# EAGLE design A2 Drums (EAGLE 8.1.1)
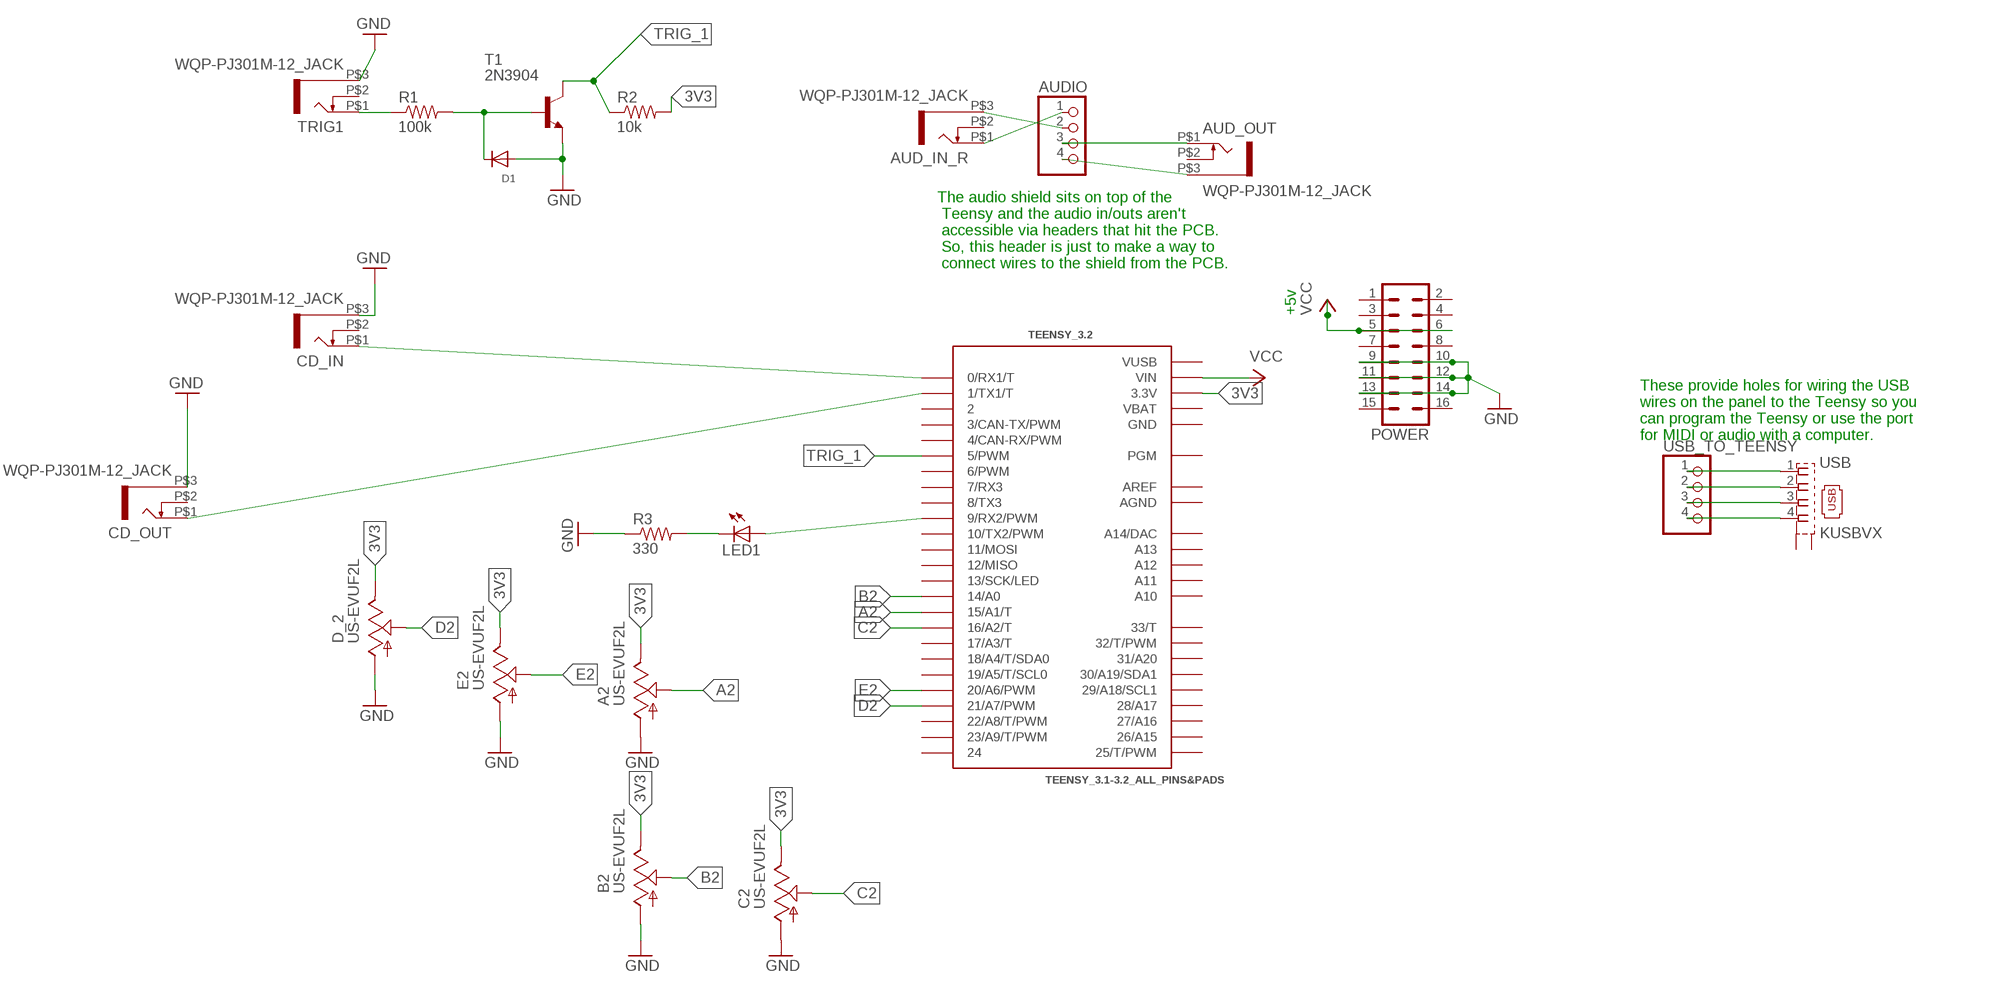
[diagram p0: schematic, sheet 1]

## Parts
A2  US-EVUF2L  [EVUFXL]
AUD_IN_R  WQP-PJ301M-12_JACK  [WQP-PJ301M-12_JACK]
AUD_OUT  WQP-PJ301M-12_JACK  [WQP-PJ301M-12_JACK]
AUDIO  PINHD-1X4  [1X04]
B2  US-EVUF2L  [EVUFXL]
C2  US-EVUF2L  [EVUFXL]
CD_IN  WQP-PJ301M-12_JACK  [WQP-PJ301M-12_JACK]
CD_OUT  WQP-PJ301M-12_JACK  [WQP-PJ301M-12_JACK]
D1  DIODESOD-123  [SOD-123]
D_2  US-EVUF2L  [EVUFXL]
E2  US-EVUF2L  [EVUFXL]
LED1  LED3MM  [LED3MM]
POWER  MA08-2  [MA08-2]
R1  100k  R-US_R0805  [R0805]
R2  10k  R-US_R0805  [R0805]
R3  330  R-US_R0805  [R0805]
T1  2N3904  [TO92]
TEENSY_3.2  TEENSY_3.1-3.2_ALL_PINS&PADS  [TEENSY_3.0-3.2_ALL_PINS_&_PADS]
TRIG1  WQP-PJ301M-12_JACK  [WQP-PJ301M-12_JACK]
USB  KUSBVX  [KUSBVX]
USB_TO_TEENSY  PINHD-1X4  [1X04]

## Nets
3V3: A2.3(E) B2.3(E) C2.3(E) D_2.3(E) E2.3(E) R2.2 TEENSY_3.2.3.3V TEENSY_3.2.3.3V1(3.3V) TEENSY_3.2.3.3V2(3.3V)
A2: A2.2(S) TEENSY_3.2.15/A1(15/A1/T)
B2: B2.2(S) TEENSY_3.2.14/A0
C2: C2.2(S) TEENSY_3.2.16/A2(16/A2/T)
CD_IN: CD_IN.P$1 TEENSY_3.2.0(0/RX1/T)
CD_OUT: CD_OUT.P$1 TEENSY_3.2.1(1/TX1/T)
D2: D_2.2(S) TEENSY_3.2.21/A7(21/A7/PWM)
E2: E2.2(S) TEENSY_3.2.20/A6(20/A6/PWM)
GND: A2.1(A) B2.1(A) C2.1(A) CD_IN.P$3 CD_OUT.P$3 D1.A D_2.1(A) E2.1(A) POWER.9 POWER.10 POWER.11 POWER.12 POWER.13 POWER.14 R3.1 T1.3(E) TRIG1.P$3
IN_R_+: AUD_IN_R.P$1 AUDIO.1
IN_R_-: AUD_IN_R.P$3 AUDIO.2
N$1: LED1.A TEENSY_3.2.9(9/RX2/PWM)
N$2: LED1.K(C) R3.2
N$3: R1.1 TRIG1.P$1
N$4: D1.C R1.2 T1.2(B)
N$38: USB.1 USB_TO_TEENSY.1
N$39: USB.2 USB_TO_TEENSY.2
N$40: USB.3 USB_TO_TEENSY.3
N$41: USB.4 USB_TO_TEENSY.4
OUT_R_+: AUD_OUT.P$1 AUDIO.3
OUT_R_-: AUD_OUT.P$3 AUDIO.4
TRIG_1: R2.1 T1.1(C) TEENSY_3.2.5(5/PWM)
VCC: POWER.5 POWER.6 TEENSY_3.2.VIN
Unconnected: AUD_IN_R.P$2 AUD_OUT.P$2 CD_IN.P$2 CD_OUT.P$2 POWER.1 POWER.2 POWER.3 POWER.4 POWER.7 POWER.8 POWER.15 POWER.16 TEENSY_3.2.2 TEENSY_3.2.3(3/CAN-TX/PWM) TEENSY_3.2.4(4/CAN-RX/PWM) TEENSY_3.2.6(6/PWM) TEENSY_3.2.7(7/RX3) TEENSY_3.2.8(8/TX3) TEENSY_3.2.10(10/TX2/PWM) TEENSY_3.2.11(11/MOSI) TEENSY_3.2.12(12/MISO) TEENSY_3.2.13(13/SCK/LED) TEENSY_3.2.17/A3(17/A3/T) TEENSY_3.2.18/A4(18/A4/T/SDA0) TEENSY_3.2.19/A5(19/A5/T/SCL0) TEENSY_3.2.22/A8(22/A8/T/PWM) TEENSY_3.2.23/A9(23/A9/T/PWM) TEENSY_3.2.24 TEENSY_3.2.25(25/T/PWM) TEENSY_3.2.26(26/A15) TEENSY_3.2.27(27/A16) TEENSY_3.2.28(28/A17) TEENSY_3.2.29(29/A18/SCL1) TEENSY_3.2.30(30/A19/SDA1) TEENSY_3.2.31(31/A20) TEENSY_3.2.32(32/T/PWM) TEENSY_3.2.33(33/T) TEENSY_3.2.A10 TEENSY_3.2.A11 TEENSY_3.2.A12 TEENSY_3.2.A13 TEENSY_3.2.PGM TEENSY_3.2.RESET/DAC(A14/DAC) TRIG1.P$2 USB.M1(S1) USB.M2(S2)

## Notes on the sheet
- The audio shield sits on top of the
   Teensy and the audio in/outs aren't
   accessible via headers that hit the PCB.
   So, this header is just to make a way to
   connect wires to the shield from the PCB.
- +5v
- These provide holes for wiring the USB
  wires on the panel to the Teensy so you 
  can program the Teensy or use the port
  for MIDI or audio with a computer.

## Power pins joined to a net without a drawn wire
AGND: TEENSY_3.2.AGND
AREF: TEENSY_3.2.AREF
GND: TEENSY_3.2.GND TEENSY_3.2.GND1(GND) TEENSY_3.2.GND2(GND)
VBAT: TEENSY_3.2.VBAT
VUSB: TEENSY_3.2.VUSB

## Library data of the parts
A2 B2 C2 D_2 E2 = pot:US-EVU: 9 mm Square Rotary Potentiometers Source: Panasonic
AUD_IN_R AUD_OUT CD_IN CD_OUT TRIG1 = thonkiconn:WQP-PJ301M-12_JACK
AUDIO USB_TO_TEENSY = pinhead:PINHD-1X4: PIN HEADER
D1 = adafruit:DIODE: Diode SMADIODE - SMA Surface Mount Package 20V 1A Schottky Diode Digikey: 641-1014-6-ND DO-1N4148 - Through Hole Small Current Diode SOD-123 20V 1 A (.5mV Vf) Schottky Diode - Digikey: MBRX120TPMSCT-ND SOD-323 10V 570mA (.38mV Vf, 3ns) Schottky Diode - Digikey: ZLLS410CT-ND SOD-523 30V 30mA Schottky Diode (RB751S-40TE61) - Digikey: RB751S-40TE61CT-ND SOT23-R/W - SOT23 Package (R = Solder Paste/Reflow Ovens, W = Hand-Soldering) BAT54Film 40V 300mA - Digikey: 497-7162-1-ND
LED1 = adafruit:LED: LED OSRAM: - CHIPLED LG R971, LG N971, LY N971, LG Q971, LY Q971, LO R971, LY R971 LH N974, LH R974 LS Q976, LO Q976, LY Q976 LO Q996 - Hyper CHIPLED LW Q18S LB Q993, LB Q99A, LB R99A - SideLED LS A670, LO A670, LY A670, LG A670, LP A670 LB A673, LV A673, LT A673, LW A673 LH A674 LY A675 LS A676, LA A676, LO A676, LY A676, LW A676 LS A679, LY A679, LG A679 - Hyper Micro SIDELED® LS Y876, LA Y876, LO Y876, LY Y876 LT Y87S - SmartLED LW L88C, LW L88S LB L89C, LB L89S, LG L890 LS L89K, LO L89K, LY L89K LS L896, LA L896, LO L896, LY L896 - TOPLED LS T670, LO T670, LY T670, LG T670, LP T670 LSG T670, LSP T670, LSY T670, LOP T670, LYG T670 LG T671, LOG T671, LSG T671 LB T673, LV T673, LT T673, LW T673 LH T674 LS T676, LA T676, LO T676, LY T676, LB T676, LH T676, LSB T676, LW T676 LB T67C, LV T67C, LT T67C, LS T67K, LO T67K, LY T67K, LW E67C LS E67B, LA E67B, LO E67B, LY E67B, LB E67C, LV E67C, LT E67C LW T67C LS T679, LY T679, LG T679 LS T770, LO T770, LY T770, LG T770, LP T770 LB T773, LV T773, LT T773, LW T773 LH T774 LS E675, LA E675, LY E675, LS T675 LS T776, LA T776, LO T776, LY T776, LB T776 LHGB T686 LT T68C, LB T68C - Hyper Mini TOPLED® LB M676 - Mini TOPLED Santana® LG M470 LS M47K, LO M47K, LY M47K Source: http://www.osram.convergy.de/
POWER = con-lstb:MA08-2: PIN HEADER; OC_FARNELL: unknown; OC_NEWARK: unknown
R1-R3 = resistor:R-US_: RESISTOR, American symbol
T1 = transistor:2N3904: NPN TRANSISTOR
TEENSY_3.2 = Teensy_3_and_LC_Series_Boards_v1.4:TEENSY_3.1-3.2_ALL_PINS&PADS: Footprint for Teensy 3.1 or 3.2 board using all pads and all through-holes. Pads need a 2x7 0.1" SMD header.
USB = con-kycon:KUSBVX: Vertical,Top Entry Universal Serial Bus Connector KUSBVX Series Source: KYCON Sibalco USB vertical socket KUSBV.pdf

## Board
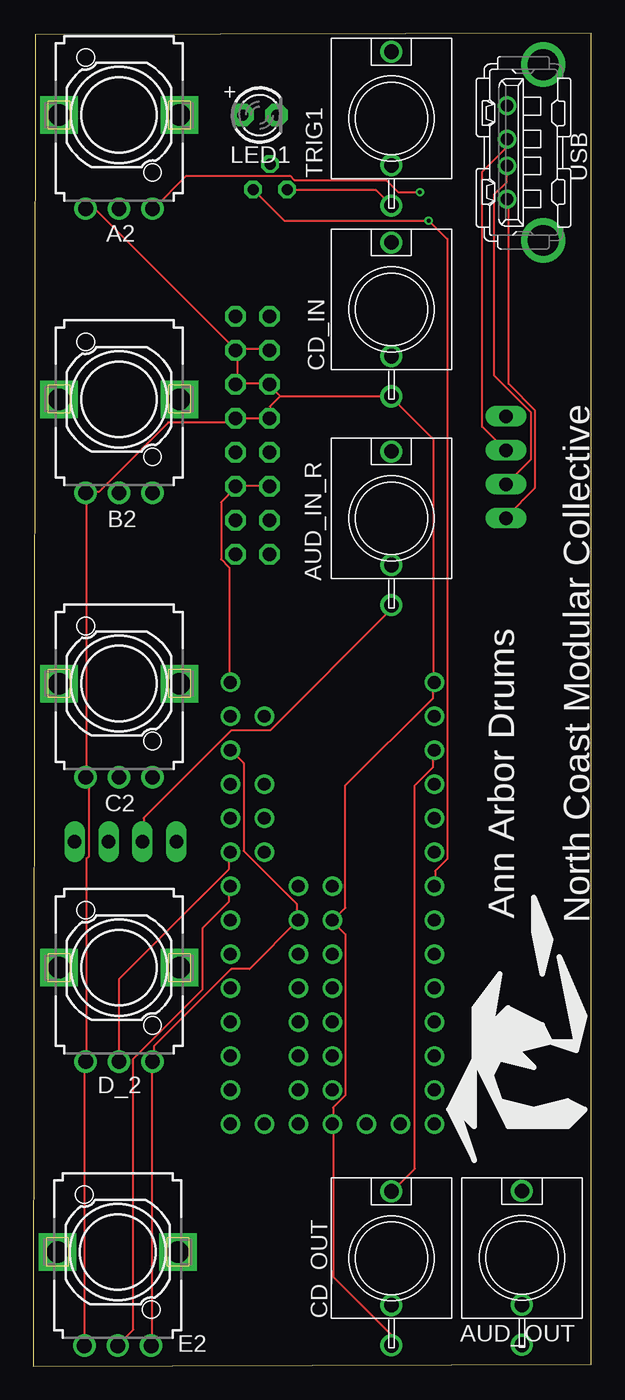
[diagram p1: board, top side]
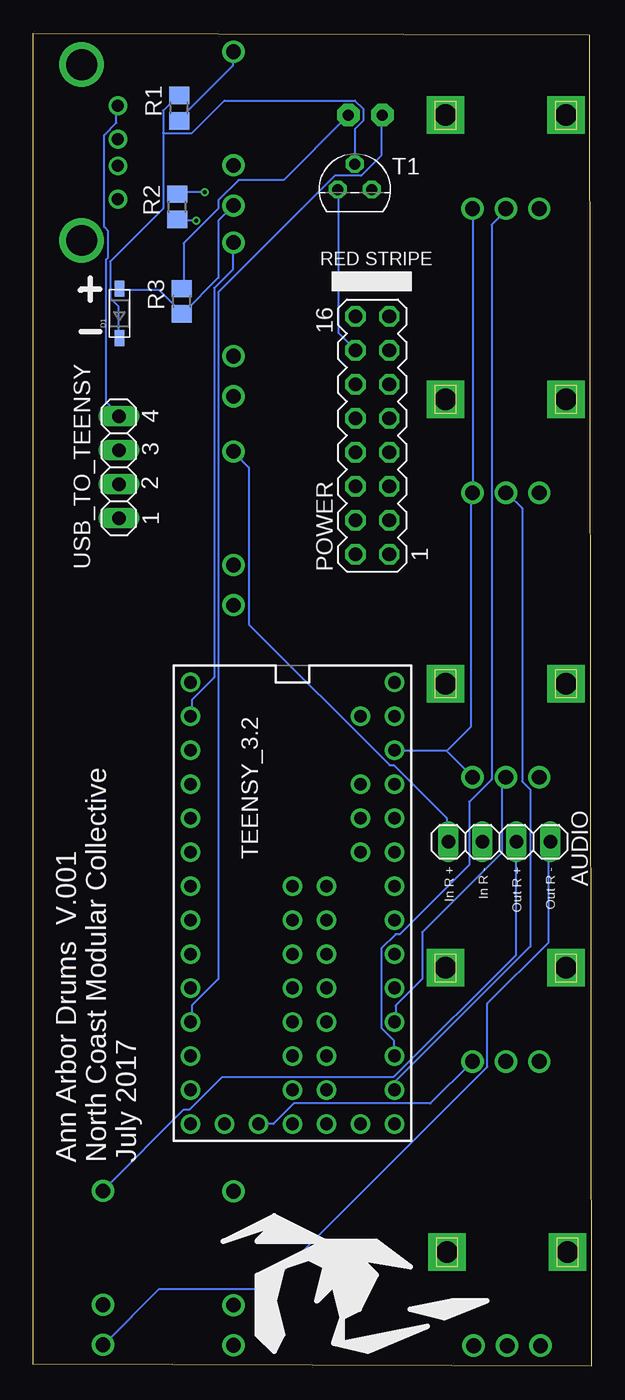
[diagram p2: board, bottom side, seen from below]

Size 41.7 x 99.62 mm. Coordinates in mm from the lower left corner, seen from the top.
Outline: 0,0 41.7,0.12 41.7,99.62 0.15,99.53 0,0
Copper layers (1*16): Top 0.035mm / dielectric 1.5mm / Bottom 0.035mm
Design rules "Smart Prototyping - NOA Eagle Rule 2016-06-12": minimum track width 6mil, minimum drill 0.3mm, track to track 6mil, track to pad 6mil, pad to pad 6mil, via to via 6mil, smd to smd 0mil, copper to edge 0.4mm, drill to drill 10mil, minimum pad ring 10mil, minimum via ring 6mil, stop-mask expansion 2mil, vias tented up to drill 25mil, thermal gap 10mil

### Footprints (pad centres in the part's own frame; a part is rotated, then mirrored left to right if it is on the bottom)
EVUFXL = drill 1.1 pad 1.676: 1 -2.5,-7; 2 0,-7; 3 2.5,-7 | drill 1.6 pad 2.8 square: M1 4.5,0; M2 -4.5,0
WQP-PJ301M-12_JACK = drill 1.1: P$1 0,5; P$2 0,-3.5; P$3 0,-6.5
1X04 = drill 1.016 long: 1 -3.81,0; 2 -1.27,0; 3 1.27,0; 4 3.81,0
SOD-123 = smd 1.2 x 0.7: A 1.85,0; C -1.85,0
LED3MM = drill 0.813 pad 1.676 octagon: A -1.27,0; K 1.27,0
MA08-2 = drill 1.016 octagon: 1 -8.89,-1.27; 2 -8.89,1.27; 3 -6.35,-1.27; 4 -6.35,1.27; 5 -3.81,-1.27; 6 -3.81,1.27; 7 -1.27,-1.27; 8 -1.27,1.27; 9 1.27,-1.27; 10 1.27,1.27; 11 3.81,-1.27; 12 3.81,1.27; 13 6.35,-1.27; 14 6.35,1.27; 15 8.89,-1.27; 16 8.89,1.27
R0805 = smd 1.3 x 1.5: 1 -0.95,0; 2 0.95,0
TO92 = drill 0.813 octagon: 1 1.27,0; 2 0,1.905; 3 -1.27,0
TEENSY_3.0-3.2_ALL_PINS_&_PADS = drill 0.965: 0 -7.62,13.97; 1 -7.62,11.43; 2 -7.62,8.89; 3 -7.62,6.35; 3.3V 7.62,11.43; 3.3V1 -2.54,-16.51; 3.3V2 2.54,-1.27; 4 -7.62,3.81; 5 -7.62,1.27; 6 -7.62,-1.27; 7 -7.62,-3.81; 8 -7.62,-6.35; 9 -7.62,-8.89; 10 -7.62,-11.43; 11 -7.62,-13.97; 12 -7.62,-16.51; 13 7.62,-16.51; 14/A0 7.62,-13.97; 15/A1 7.62,-11.43; 16/A2 7.62,-8.89; 17/A3 7.62,-6.35; 18/A4 7.62,-3.81; 19/A5 7.62,-1.27; 20/A6 7.62,1.27; 21/A7 7.62,3.81; 22/A8 7.62,6.35; 23/A9 7.62,8.89; 24 0,-3.81; 25 0,-6.35; 26 0,-8.89; 27 0,-11.43; 28 0,-13.97; 29 2.54,-13.97; 30 2.54,-11.43; 31 2.54,-8.89; 32 2.54,-6.35; 33 2.54,-3.81; A10 5.08,6.35; A11 5.08,3.81; A12 0,1.27; A13 2.54,1.27; AGND 7.62,13.97; AREF 5.08,8.89; GND -7.62,16.51; GND1 0,-16.51; GND2 0,-1.27; PGM 2.54,-16.51; RESET/DAC 5.08,-16.51; VBAT -5.08,-16.51; VIN 7.62,16.51; VUSB 5.08,13.97
KUSBVX = drill 0.9 pad 1.3: 1 3.5,0; 2 1,0; 3 -1,0; 4 -3.5,0 | drill 2.3 pad 2.8: M1 -6.57,2.71; M2 6.57,2.71

### Placement (x,y rotation side)
A2  6.4,93.52 0 top
AUD_IN_R  26.75,63.38 0 top
AUD_OUT  36.5,8.09 0 top
AUDIO  6.88,39.2 0 bottom
B2  6.4,72.27 0 top
C2  6.4,51.02 0 top
CD_IN  26.75,78.99 0 top
CD_OUT  26.75,8.06 0 top
D1  35.28,78.69 90 bottom
D_2  6.4,29.77 0 top
E2  6.3,8.52 0 top
LED1  16.9,93.52 0 top
POWER  16.38,69.57 90 bottom
R1  30.81,94.04 90 bottom
R2  30.95,86.65 90 bottom
R3  30.61,79.59 90 bottom
T1  17.69,87.96 0 bottom
TEENSY_3.2  22.34,34.6 0 bottom
TRIG1  26.75,93.26 0 top
USB  35.39,90.72 270 top
USB_TO_TEENSY  35.32,67.19 90 bottom

### Tracks (layer width: path | path; a pad name or v marks a point on that pad's centre or on a via)
3V3  (via drill 0.3)
  Top 0.152: E2.3 8.84,1.65 8.84,22.68 D_2.3 8.99,22.83 8.99,23.9 14.78,29.69 16.15,29.69 TEENSY_3.2.3.3V2 19.66,33.34 19.66,34.56 15.7,38.53 15.7,45.08 14.78,45.99 TEENSY_3.2.3.3V | v28.89,87.75 27.28,87.75 26.36,88.67 19.51,88.67 19.2,88.97 11.43,88.97 8.99,86.53 A2.3
  Bottom 0.152: TEENSY_3.2.3.3V1 24.84,18.1 23.77,18.1 22.25,19.63 12.04,19.63 8.99,22.68 D_2.3 | v28.89,87.75 30.94,87.75 R2.2 | 10.82,45.99 14.63,45.99 TEENSY_3.2.3.3V | 10.82,45.99 8.99,44.17 C2.3 | 10.82,45.99 8.99,47.82 8.99,65.2 B2.3 8.84,65.35 8.84,86.38 A2.3
A2
  Bottom 0.152: TEENSY_3.2.15/A1 14.78,23.29 14.78,24.35 15.7,25.27 15.7,31.21 14.63,32.28 14.33,32.28 9.14,37.46 9.14,42.18 7.47,43.86 7.47,85.31 6.4,86.38 A2.2
B2
  Bottom 0.152: TEENSY_3.2.14/A0 14.63,20.7 14.63,21.31 4.57,31.36 4.57,43.1 5.18,43.71 5.18,64.13 6.25,65.2 B2.2
C2
  Bottom 0.152: TEENSY_3.2.16/A2 14.63,25.72 14.63,26.94 12.65,28.93 12.65,32.43 6.71,38.37 6.71,43.71 C2.2
CD_IN
  Bottom 0.152: TEENSY_3.2.0 29.87,48.58 29.87,49.8 28.19,51.48 28.19,80.59 26.82,81.96 26.82,83.94 CD_IN.P$1
CD_OUT
  Top 0.152: TEENSY_3.2.1 29.87,45.99 29.87,44.77 28.5,43.4 28.5,14.75 26.82,13.08 CD_OUT.P$1
D2
  Top 0.152: TEENSY_3.2.21/A7 14.63,38.37 14.63,37.15 6.4,28.93 6.4,22.83 D_2.2
E2
  Top 0.152: TEENSY_3.2.20/A6 14.63,35.78 14.63,34.72 12.65,32.74 12.65,28.16 7.47,22.98 7.47,2.71 6.4,1.65 E2.2
GND
  Top 0.152: CD_OUT.P$3 26.67,1.65 26.67,2.41 22.4,6.67 22.4,17.95 TEENSY_3.2.GND1 22.4,18.1 22.4,19.32 23.32,20.24 23.32,32.28 22.4,33.19 TEENSY_3.2.GND2 22.4,33.34 23.32,34.26 23.32,43.4 29.87,49.96 29.87,51.02 TEENSY_3.2.GND 29.87,51.18 29.87,69.31 26.82,72.36 CD_IN.P$3 26.67,72.51 18.44,72.51 | T1.3 19.05,87.9 25.6,87.9 26.67,86.84 TRIG1.P$3 | E2.1 3.81,1.65 3.81,22.68 D_2.1 3.96,22.83 3.96,37.92 4.12,38.07 4.12,43.86 3.96,44.01 C2.1 3.96,44.17 3.96,65.2 B2.1 3.96,65.35 4.88,65.35 10.06,70.53 14.78,70.53 15.09,70.84 POWER.9 POWER.10 17.68,70.84 17.68,71.75 18.44,72.51 | 15.24,73.43 17.53,73.43 POWER.12 17.68,73.27 18.44,72.51 | POWER.13 15.24,76.02 17.53,76.02 POWER.14 | A2.1 3.96,86.38 4.72,86.38 15.09,76.02 POWER.13 | 15.24,73.43 15.24,75.86 POWER.13 | 15.24,73.43 POWER.11
  Bottom 0.152: D1.A 35.2,80.44 32.31,80.44 30.63,78.76 R3.1 30.48,78.76 27.89,81.35 27.89,85.62 26.82,86.68 TRIG1.P$3 | T1.3 18.9,87.9 18.9,77.24 17.68,76.02 POWER.14
IN_R_+
  Bottom 0.152: AUDIO.1 10.82,39.29 10.82,40.96 14.78,44.93 15.09,44.93 25.6,55.44 25.6,67.18 26.67,68.24 AUD_IN_R.P$1
IN_R_-
  Top 0.152: AUDIO.2 8.23,39.29 8.23,40.96 14.78,47.52 17.68,47.52 26.67,56.51 26.67,56.81 AUD_IN_R.P$3
N$1
  Bottom 0.152: TEENSY_3.2.9 29.87,25.72 29.87,26.94 27.89,28.93 27.89,80.28 19.2,88.97 17.22,88.97 15.7,90.49 15.7,93.39 LED1.A
N$2
  Bottom 0.152: R3.2 30.48,80.59 30.48,83.94 27.89,86.53 27.89,87.14 26.36,88.67 23.01,88.67 18.29,93.39 LED1.K
N$3
  Bottom 0.152: R1.1 30.79,93.24 26.82,97.2 26.82,98.11 TRIG1.P$1
N$4
  Bottom 0.152: 32,92.17 32,93.85 30.94,94.91 R1.2 | 32,92.17 32,86.53 35.97,82.57 35.97,79.83 35.36,79.22 35.36,76.93 D1.C | 32,92.17 29.87,92.17 27.43,94.61 17.68,94.61 17.07,94 17.07,93.09 17.68,92.48 17.68,89.89 T1.2
N$38
  Top 0.152: USB.1 35.51,87.14 35.51,73.43 37.49,71.44 37.49,65.65 35.36,63.52 USB_TO_TEENSY.1
N$39
  Top 0.152: USB.2 35.36,89.58 35.36,88.51 34.44,87.6 34.44,74.04 37.19,71.29 37.19,67.79 35.36,65.96 USB_TO_TEENSY.2
N$40
  Top 0.152: USB.3 35.36,91.71 35.36,91.1 33.53,89.28 33.53,70.23 35.2,68.55 USB_TO_TEENSY.3
N$41
  Bottom 0.152: USB.4 35.51,94.15 35.51,92.93 36.42,92.02 36.42,85.16 36.12,84.86 36.12,82.87 36.27,82.72 36.27,72.05 35.36,71.14 USB_TO_TEENSY.4
OUT_R_+
  Bottom 0.152: AUDIO.3 5.64,39.14 5.64,30.75 14.78,21.61 27.58,21.61 30.02,19.17 30.48,19.17 36.42,13.23 AUD_OUT.P$1
OUT_R_-
  Bottom 0.152: AUDIO.4 3.2,39.14 3.2,31.67 7.77,27.1 7.77,22.37 24.38,5.76 32.31,5.76 36.42,1.65 AUD_OUT.P$3
TRIG_1  (via drill 0.3)
  Top 0.152: T1.1 16.46,87.9 18.75,85.62 v29.52,85.62 30.94,84.25 30.94,37.92 30.02,37 30.02,35.94 TEENSY_3.2.5
  Bottom 0.152: v29.52,85.62 30.94,85.62 R2.1
VCC
  Top 0.152: TEENSY_3.2.VIN 14.63,51.18 14.63,59.71 14.02,60.32 14.02,64.59 15.09,65.65 POWER.5 15.24,65.81 17.53,65.81 POWER.6

### Text on the board
tNames: Ann Arbor Drums | North Coast Modular Collective
bNames: RED STRIPE | 4 | 3 | 2 | 1 | Out R - | Out R + | In R - | In R + | Ann Arbor Drums V.001 / North Coast Modular Collective / July 2017